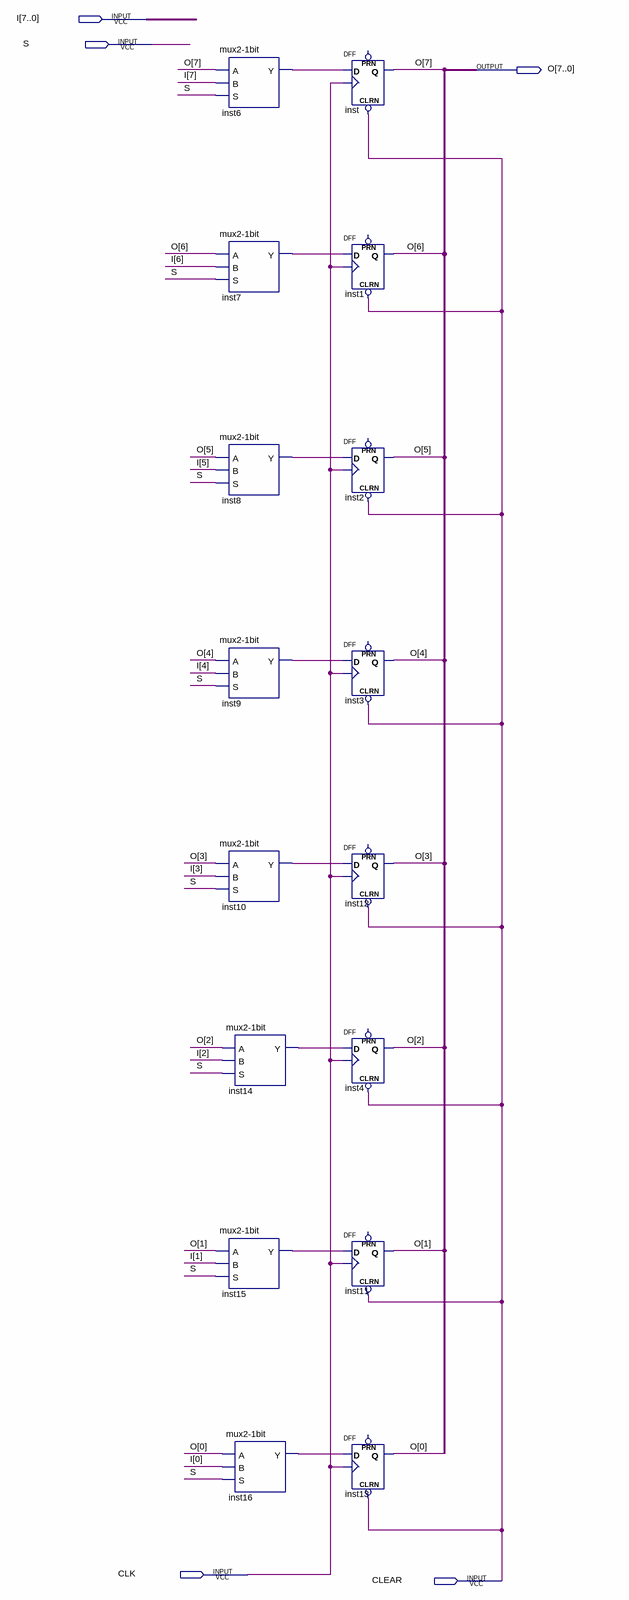
[diagram p0: schematic sheet]
// Quartus schematic RegSum.bdf as structural Verilog: 16 symbols, 5 pins
module RegSum (
  input  [7:0] I,
  input  S,
  input  CLK,
  input  CLEAR,
  output [7:0] O
);

  wire inst6_y, inst7_y, inst8_y, inst9_y, inst10_y, inst14_y, inst15_y, inst16_y;

  \mux2-1bit  inst6 (.A(O[7]), .B(I[7]), .S(S), .Y(inst6_y));
  \mux2-1bit  inst7 (.A(O[6]), .B(I[6]), .S(S), .Y(inst7_y));
  \mux2-1bit  inst8 (.A(O[5]), .B(I[5]), .S(S), .Y(inst8_y));
  \mux2-1bit  inst9 (.A(O[4]), .B(I[4]), .S(S), .Y(inst9_y));
  \mux2-1bit  inst10 (.A(O[3]), .B(I[3]), .S(S), .Y(inst10_y));
  \mux2-1bit  inst14 (.A(O[2]), .B(I[2]), .S(S), .Y(inst14_y));
  \mux2-1bit  inst15 (.A(O[1]), .B(I[1]), .S(S), .Y(inst15_y));
  \mux2-1bit  inst16 (.A(O[0]), .B(I[0]), .S(S), .Y(inst16_y));
  DFF inst (.CLRN(CLEAR), .CLK(CLK), .D(inst6_y), .Q(O[7]));  // open: PRN
  DFF inst1 (.CLRN(CLEAR), .CLK(CLK), .D(inst7_y), .Q(O[6]));  // open: PRN
  DFF inst2 (.CLRN(CLEAR), .CLK(CLK), .D(inst8_y), .Q(O[5]));  // open: PRN
  DFF inst3 (.CLRN(CLEAR), .CLK(CLK), .D(inst9_y), .Q(O[4]));  // open: PRN
  DFF inst12 (.CLRN(CLEAR), .CLK(CLK), .D(inst10_y), .Q(O[3]));  // open: PRN
  DFF inst4 (.CLRN(CLEAR), .CLK(CLK), .D(inst14_y), .Q(O[2]));  // open: PRN
  DFF inst11 (.CLRN(CLEAR), .CLK(CLK), .D(inst15_y), .Q(O[1]));  // open: PRN
  DFF inst13 (.CLRN(CLEAR), .CLK(CLK), .D(inst16_y), .Q(O[0]));  // open: PRN
endmodule
